# EAGLE design femtobuck (EAGLE 9.5.2)
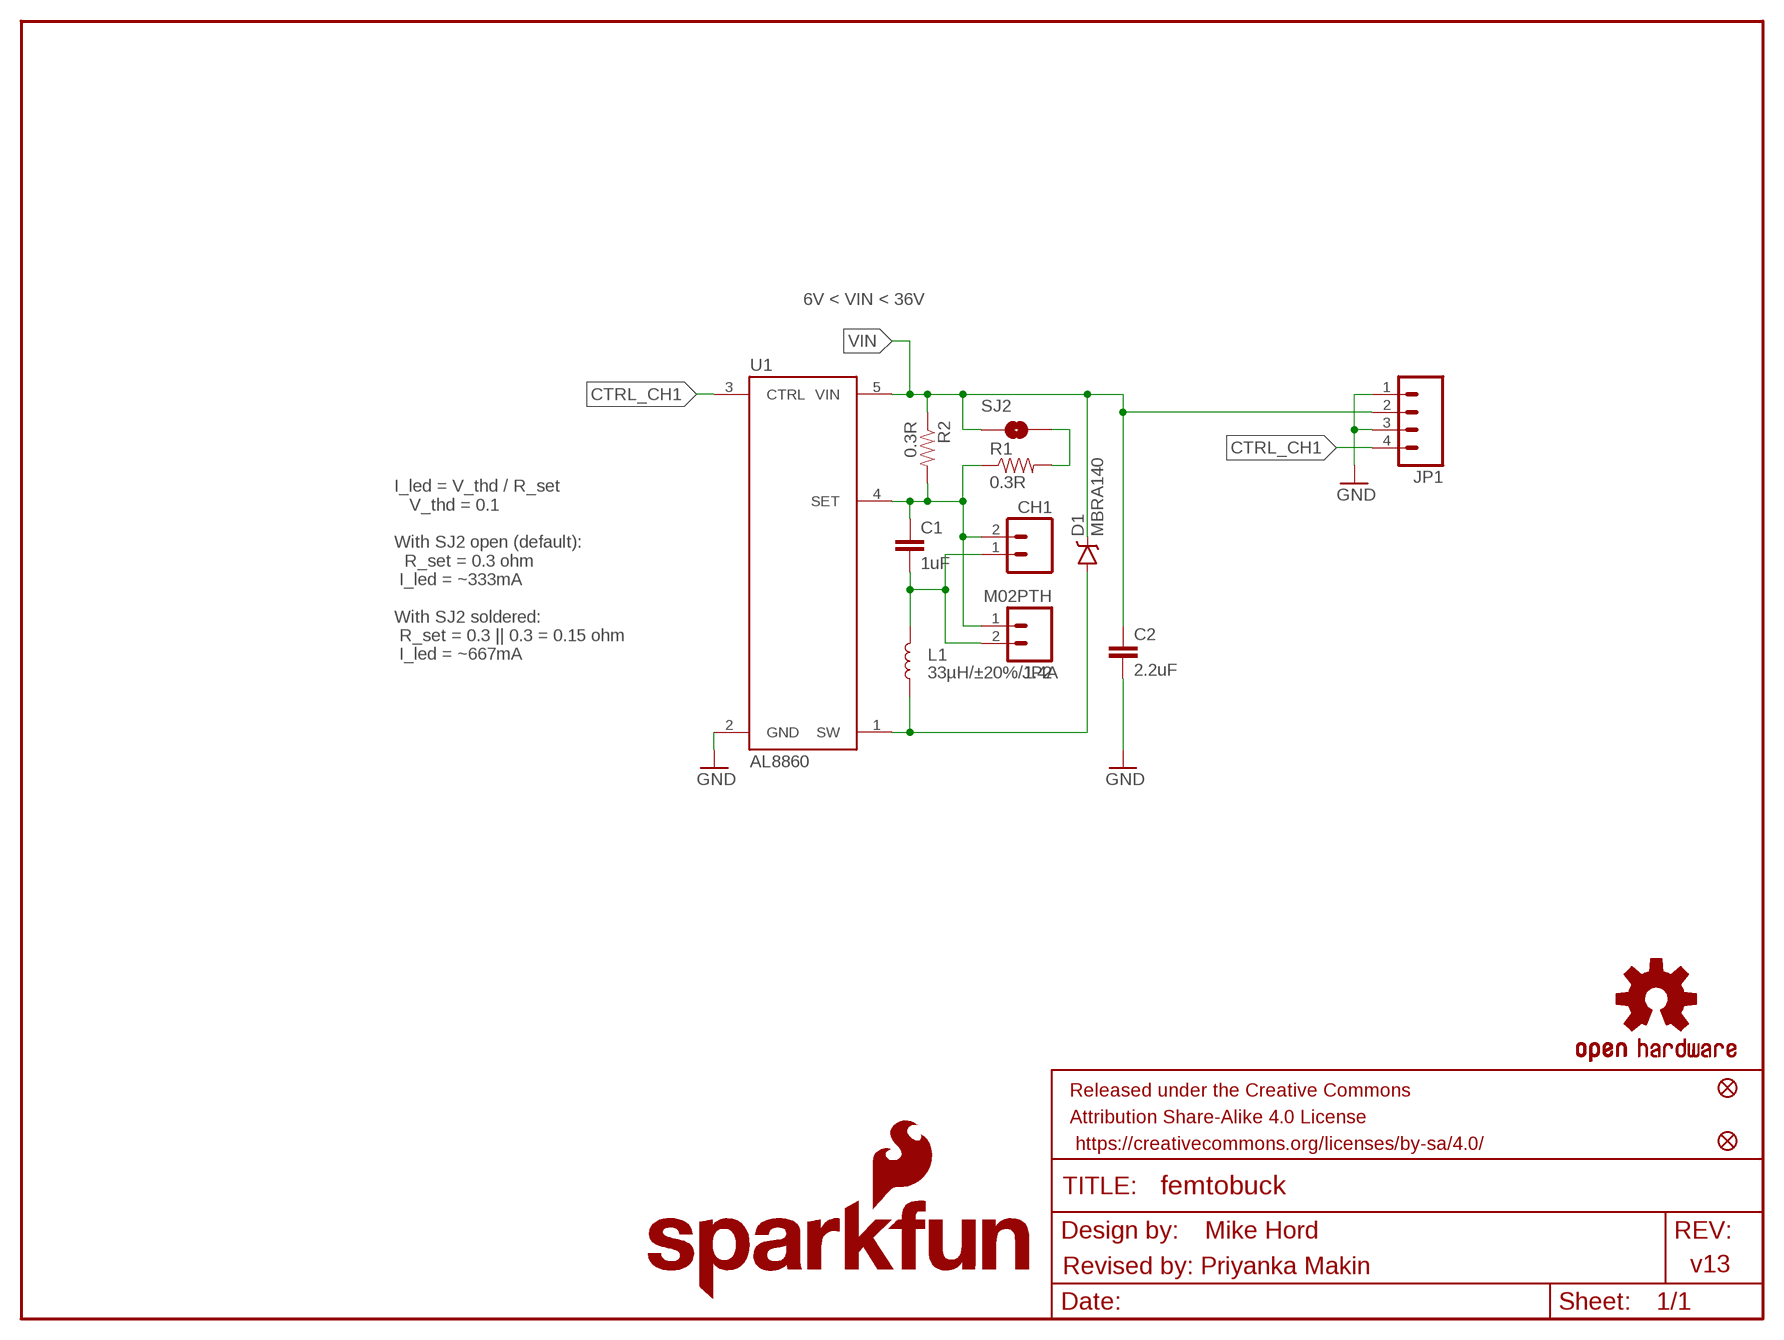
[diagram p0: schematic, sheet 1]

## Parts
C1  1uF  1.0UF50V10%(1206)  [1206-CAP]
C2  2.2uF  2.2UF50V10%(1206)  [1206-CAP]
CH1  CONN_023.5MM_LOCK  [SCREWTERMINAL-3.5MM-2_LOCK]
D1  MBRA140  DIODE-SCHOTTKY-MBRA140  [SMA-DIODE]
FID1  FIDUCIAL1X2  [FIDUCIAL-1X2]
FID2  FIDUCIAL1X2  [FIDUCIAL-1X2]
FRAME1  FRAME-LETTER  [CREATIVE_COMMONS]
JP1  M04PTH  [1X04]
JP2  M02PTH  [1X02@1]
L1  33µH/±20%/1.4A  INDUCTOR-SRN6045-33UH  [SRN6045]
LOGO1  OSHW-LOGOS  [OSHW-LOGO-S]
LOGO2  SFE_LOGO_NAME_FLAME.1_INCH  [SFE_LOGO_NAME_FLAME_.1]
R1  0.3R  0.3OHM-1/8W-1%(0805)  [0805]
R2  0.3R  0.3OHM-1/8W-1%(0805)  [0805]
SJ2  NO Jumper  JUMPER-SMT_2_NO_NO-SILK  [SMT-JUMPER_2_NO_NO-SILK]
U1  AL8860  [SOT23-5]

## Nets
CTRL_CH1: JP1.4 U1.3(CTRL)
GND: C2.2 JP1.1 JP1.3 U1.2(GND)
N$1: R1.2 SJ2.2
OUT+: C1.1 CH1.2 JP2.1 R1.1 R2.2 U1.4(SET)
OUT- [power]: C1.2 CH1.1 JP2.2 L1.2
SW: D1.A L1.1 U1.1(SW)
VIN: C2.1 D1.C JP1.2 R2.1 SJ2.1 U1.5(VIN)

## Notes on the sheet
- 6V < VIN < 36V
- I_led = V_thd / R_set
     V_thd = 0.1
  
  With SJ2 open (default):
    R_set = 0.3 ohm
   I_led = ~333mA
  
  With SJ2 soldered:
   R_set = 0.3 || 0.3 = 0.15 ohm
   I_led = ~667mA
- Mike Hord
- Revised by: Priyanka Makin | v13

## Library data of the parts
C1 = SparkFun-Capacitors:1.0UF50V10%(1206): CAP-09822
C2 = SparkFun-Capacitors:2.2UF50V10%(1206): CAP-10009
CH1 = SparkFun-Connectors:CONN_02: Multi connection point. Often used as Generic Header-pin footprint for 0.1 inch spaced/style header connections On any of the 0.1 inch spaced packages, you can populate with these: Break Away Headers - Straight <https://www.sparkfun.com/products/116> (PRT-00116) Break Away Male Headers - Right Angle <https://www.sparkfun.com/products/553> (PRT-00553) Female Headers <https://www.sparkfun.com/products/115> (PRT-00115) Break Away Headers - Machine Pin <https://www.sparkfun.com/products/117> (PRT-00117) Break Away Female Headers - Swiss Machine Pin <https://www.sparkfun.com/products/743> (PRT-00743) For SCREWTERMINALS and SPRING TERMINALS visit here: Screw Terimnals on SparkFun.com <https://www.sparkfun.com/search/results?term=Screw+Terminals> (5mm/3.5mm/2.54mm spacing) This device is also useful as a general connection point to wire up your design to another part of your project. Our various solder wires solder well into these plated through hole pads. Hook-Up Wire - Assortment (Stranded, 22 AWG) <https://www.sparkfun.com/products/11375> (PRT-11375) Hook-Up Wire - Assortment (Solid Core, 22 AWG) <https://www.sparkfun.com/products/11367> (PRT-11367) View the entire wire category on our website here <https://www.sparkfun.com/categories/141> Special notes: Molex polarized connector foot print use with: PRT-08233 with associated crimp pins and housings. 2.54_SCREWTERM for use with PRT-10571. 3.5mm Screw Terminal footprints for PRT-08084 5mm Screw Terminal footprints for use with PRT-08432; PROD_ID: CONN-08399
D1 = SparkFun-DiscreteSemi:DIODE-SCHOTTKY: Schottky diodes in SFE's production catalog BAT20J 1A 23V 0.62Vf RB751 120mA 40V 0.37Vf PMEG4005EJ 0.5A 40V 0.42Vf MBRA140 1A 40V 0.5Vf B340A 3A 40V SMA; PROD_ID: DIO-08053
FID1 FID2 = SparkFun-Aesthetics:FIDUCIAL: Fiducial Alignment Points Point-of-reference for pick-and-place machines and other optical instruments.
FRAME1 = SparkFun-Aesthetics:FRAME-LETTER: Schematic Frame - Letter Standard 8.5x11 US Letter frame
JP1 = SparkFun-Connectors:M04: Header 4 Standard 4-pin 0.1" header. Use with straight break away headers (SKU : PRT-00116), right angle break away headers (PRT-00553), swiss pins (PRT-00743), machine pins (PRT-00117), and female headers (PRT-00115). Molex polarized connector foot print use with SKU : PRT-08231 with associated crimp pins and housings. 1MM SMD Version SKU: PRT-10208
JP2 = SparkFun-Connectors:M02: Standard 2-pin 0.1" header. Use with - straight break away headers ( PRT-00116) - right angle break away headers (PRT-00553) - swiss pins (PRT-00743) - machine pins (PRT-00117) - female headers (PRT-00115) Molex polarized connector foot print use with: PRT-08233 with associated crimp pins and housings. 2.54_SCREWTERM for use with PRT-10571. 3.5mm Screw Terminal footprints for PRT-08084 5mm Screw Terminal footprints for use with PRT-08433
L1 = SparkFun-Coils:INDUCTOR: Inductors Resist changes in electrical current. Basically a coil of wire. SparkFun Products: SparkFun Load Cell Amplifier - HX711 <https://www.sparkfun.com/products/13879> IOIO-OTG - V2.2 <https://www.sparkfun.com/products/13613>; PROD_ID: NDUC-11627
LOGO1 = SparkFun-Aesthetics:OSHW-LOGO: Open-Source Hardware (OSHW) Logo This logo indicates the piece of hardware it is found on incorporates a OSHW license and/or adheres to the definition of open source hardware found here: http://freedomdefined.org/OSHW
LOGO2 = SparkFun-Aesthetics:SFE_LOGO_NAME_FLAME: SparkFun Font Logo w/ Flame This is the SparkFun full logo. The logo on the schematic will always be the same size; the package variant is the height of the flame part of the logo. Default layer for the logo on the board is tSilk.
R1 R2 = SparkFun-Resistors:0.3OHM-1/8W-1%(0805): RES-11622; PROD_ID: RES-11622; VALUE: 0.3
SJ2 = SparkFun-Jumpers:JUMPER-SMT_2_NO: Normally open jumper This jumper has two pads in close proximity to each other. Apply solder to close the connection. Round pads are easier to solder for beginners, but are a lot larger. SparkFun Product that uses the round pads: SparkFun EL Sequencer <https://www.sparkfun.com/products/12781>
U1 = SparkFun-IC-Special-Function:AL8860; PROD-ID: IC-16593

## Net classes
0 default: width 0.254 mm
1 power: width 0.508 mm

## Board
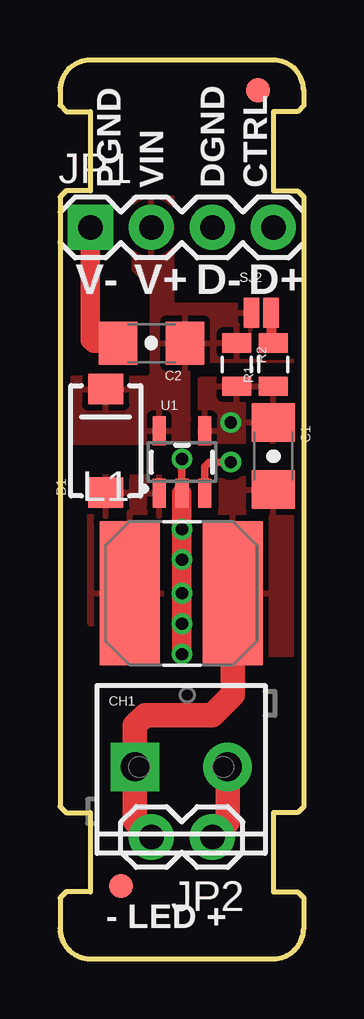
[diagram p1: board, top side]
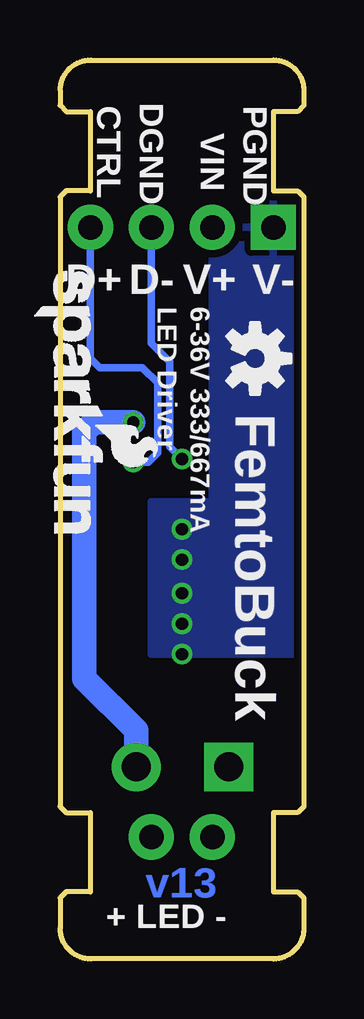
[diagram p2: board, bottom side, seen from below]

Size 10.16 x 37.45 mm. Coordinates in mm from the lower left corner, seen from the top.
Outline: 10.15,1.27 arc-90 8.88,0 1.27,0 arc-90 0,1.27 0,2.54 0.25,2.79 1.27,2.79 1.27,6.1 0.25,6.1 0,6.35 0,31.75 0.25,32 1.27,32 1.27,35.31 0.25,35.31 0,35.56 0,36.2
Outline: 10.15,36.18 arc90 8.88,37.45 1.27,37.45 arc90 0,36.18
Outline: 10.16,36.2 10.16,35.56 9.91,35.31 8.89,35.31 8.89,32 9.91,32 10.16,31.75 10.16,6.35 9.91,6.1 8.89,6.1 8.89,2.79 9.91,2.79 10.16,2.54 10.16,1.27
Copper layers (1*16): Top 0.035mm / dielectric 1.5mm / Bottom 0.035mm
Design rules "SparkFun-2-layer": minimum track width 7mil, minimum drill 15mil, track to track 8mil, track to pad 8mil, pad to pad 8mil, via to via 8mil, smd to smd 8mil, copper to edge 8mil, drill to drill 8mil, minimum pad ring 12mil, minimum via ring 7mil, stop-mask expansion 4mil, vias tented up to drill 20mil, thermal gap 10mil

### Footprints (pad centres in the part's own frame; a part is rotated, then mirrored left to right if it is on the bottom)
1206-CAP = smd 1.6 x 1.8: 1 -1.4,0; 2 1.4,0
SCREWTERMINAL-3.5MM-2_LOCK = drill 1.2 pad 2.032 square: 1 -0.178,0 | drill 1.2 pad 2.032: 2 3.678,0
SMA-DIODE = smd 1.27 x 1.47: A -2.15,0; C 2.15,0
FIDUCIAL-1X2 = smd 1 x 1: 1 0,0
1X04 = drill 1.016 pad 1.88 square: 1 0,0 | drill 1.016 pad 1.88: 2 2.54,0; 3 5.08,0; 4 7.62,0
1X02@1 = drill 1.016 pad 1.88: 1 0,0; 2 2.54,0
SRN6045 = smd 2.5 x 6: 1 -2.175,0; 2 2.125,0
0805 = smd 0.8 x 1.2: 1 -0.9,0; 2 0.9,0
SMT-JUMPER_2_NO_NO-SILK = smd 0.635 x 1.27: 1 -0.406,0; 2 0.406,0
SOT23-5 = smd 0.55 x 1.2: 1 -0.95,-1.3; 2 0,-1.3; 3 0.95,-1.3; 4 0.95,1.3; 5 -0.95,1.3

### Placement (x,y rotation side)
C1  8.89,20.96 270 top
C2  3.81,25.65 180 top
CH1  3.3,8 0 top
D1  1.91,21.59 90 top
FID1  8.26,36.2 0 top
FID2  2.54,3.05 0 top
FRAME1  11.43,-21.59 0 top  (outside the outline)
JP1  1.27,30.48 0 top
JP2  6.35,5.08 180 top
L1  5.08,15.24 0 top
LOGO1  2.03,25.02 270 bottom
LOGO2  9.78,23.11 270 bottom
R1  8.89,24.77 90 top
R2  7.37,24.77 270 top
SJ2  8.38,26.92 0 top
U1  5.08,20.7 0 top

### Tracks (layer width: path | path; a pad name or v marks a point on that pad's centre or on a via)
CTRL_CH1  (via drill 0.51)
  Top 0.305: U1.3 6.03,20.51 6.22,20.7 v7.11,20.7
  Bottom 0.305: v7.11,20.7 6.48,20.7 6.1,21.08 6.1,24 6.73,24.64 8.51,24.64 8.89,25.02 JP1.4
GND  (via drill 0.51)
  Top 0.305: U1.2 v5.08,20.83
  Top 0.813: U1.2 v5.08,17.91 5.08,12.83 | JP1.1 1.27,25.78 1.4,25.65 C2.2
  Bottom 0.305: JP1.3 6.35,25.65 5.59,24.89 5.59,21.34 v5.08,20.83
  other vias: 5.08,16.64 5.08,15.24 5.08,13.97 5.08,12.7
  pour Bottom (isolate 0.305): 0,31.75 3.81,31.75 3.81,19.05 6.35,19.05 6.35,12.7 0,12.7
N$1
  Top 0.406: SJ2.2 8.83,25.72 R1.2
OUT+  (via drill 0.51)
  Top 1.016: CH1.2 6.98,5.71 JP2.1
  Bottom 1.016: v7.11,22.35 8.76,22.35 9.14,21.97 9.14,11.68 6.98,9.52 CH1.2
  pour Top (isolate 0.305): 8.89,24.13 5.84,24.13 5.84,21.59 8.89,21.59
OUT-
  Top 1.016: L1.2 7.21,11.02 6.35,10.16 3.56,10.16 3.12,9.73 CH1.1 3.12,5.77 JP2.2
  pour Top (isolate 0.305): 6.35,20.19 10.16,20.19 10.16,12.7 6.35,12.7
SW
  pour Top (isolate 0.305): 1.27,20.07 5.08,20.07 5.08,13.97 1.27,13.97
VIN
  pour Top (isolate 0.305, rank 2): 3.05,31.75 4.7,31.75 4.7,27.3 10.03,27.3 9.78,24.89 6.22,24.89 5.59,24.26 5.59,21.46 0.51,21.46 0.51,24.26 3.68,24.26 3.81,24.38 3.81,27.94 3.05,28.7

### Text on the board
Bottom: v13
tPlace: PGND | VIN | DGND | CTRL | V- | V+ | D- | D+ | - LED +
bPlace: PGND | DGND | CTRL | VIN | V- | V+ | D- | D+ | 6-36V 333/667mA | LED Driver | FemtoBuck | + LED -
Measures: (typ.) | Units are inches
tDocu: M. Hord